# EAGLE design picoAvaR4-routed (EAGLE 6.1)
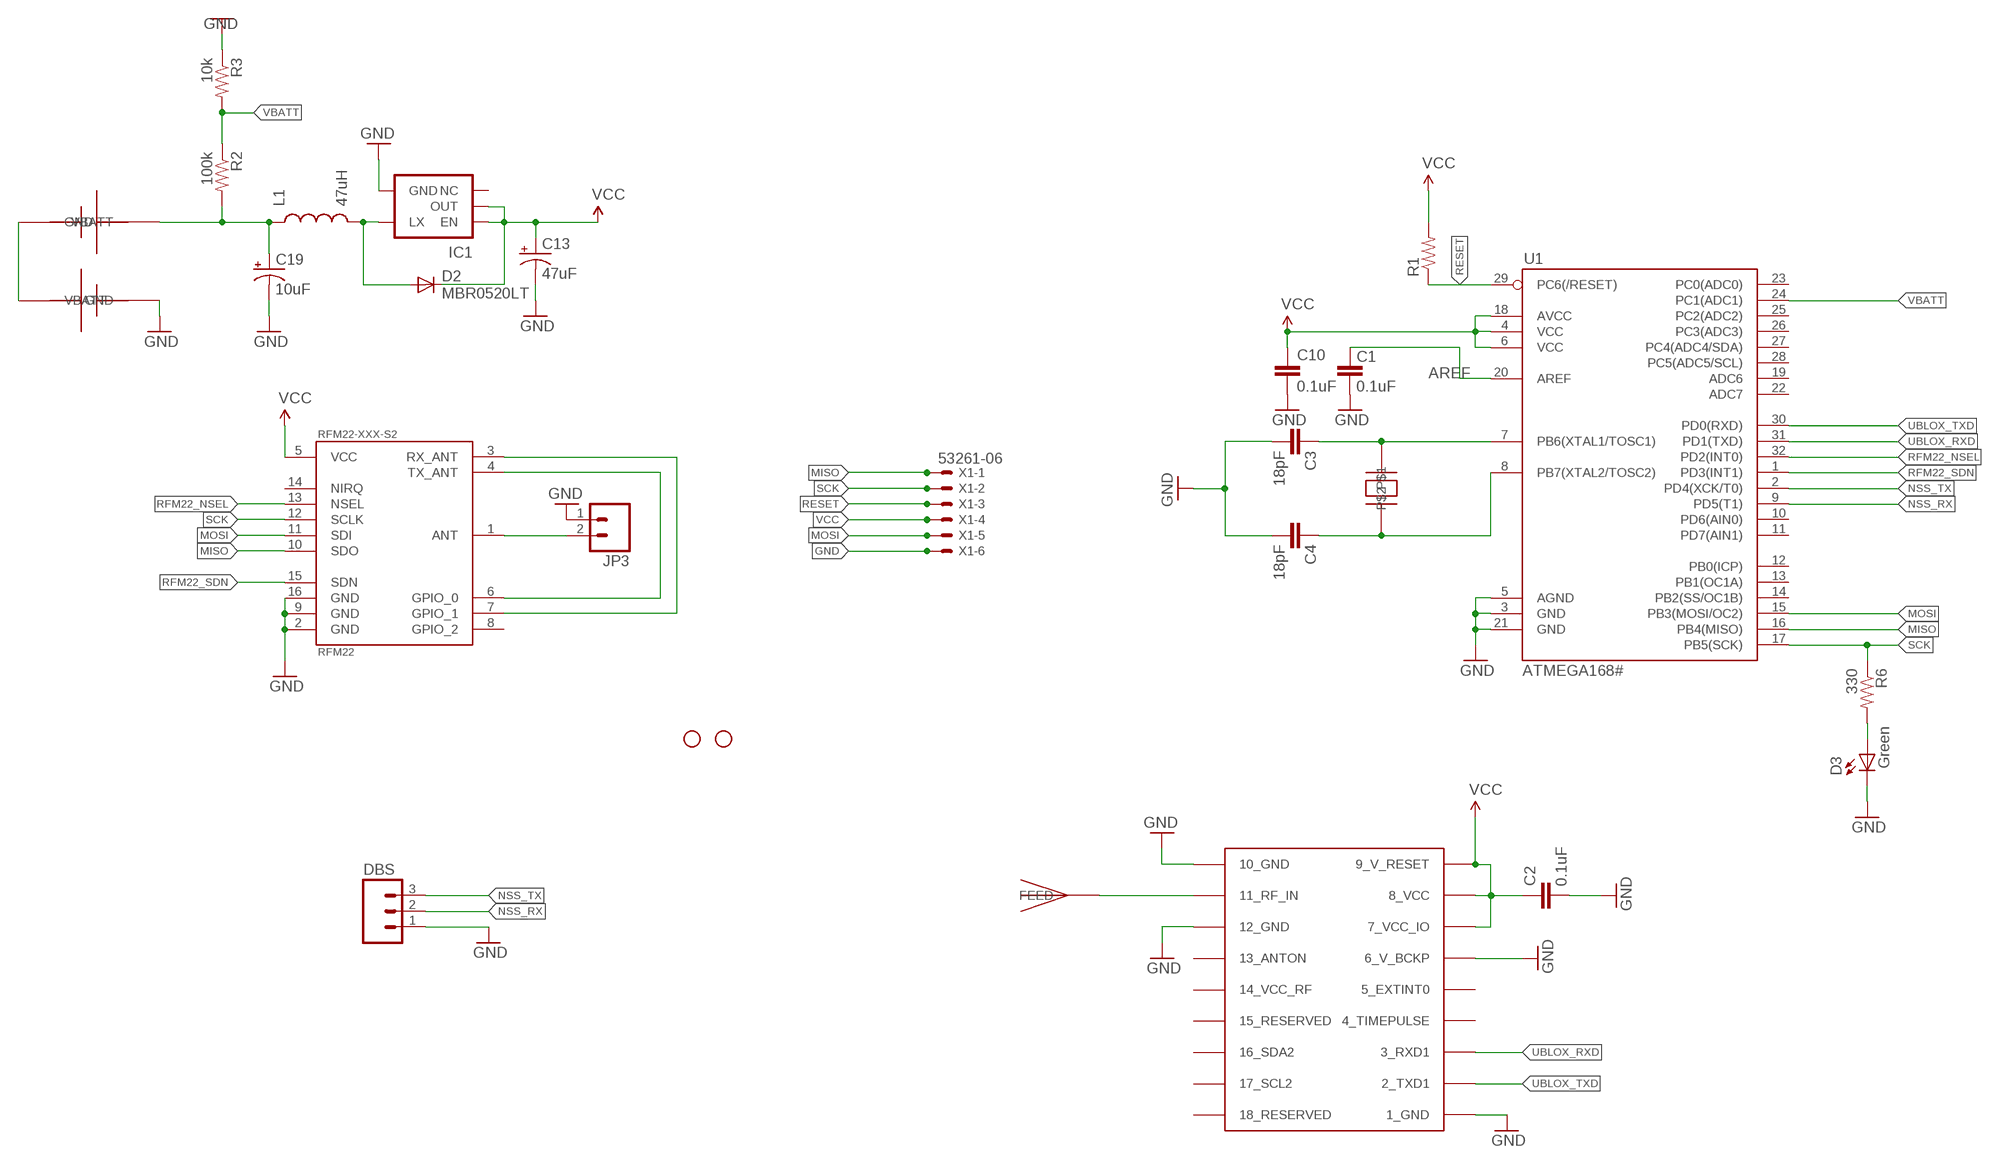
[diagram p0: schematic, sheet 1]

## Parts
C1  0.1uF  CAP0402-CAP  [0402-CAP]
C2  0.1uF  CAP0402-CAP  [0402-CAP]
C3  18pF  CAP0402-CAP  [0402-CAP]
C4  18pF  CAP0402-CAP  [0402-CAP]
C10  0.1uF  CAP0402-CAP  [0402-CAP]
C13  47uF  CAP_POL1206  [EIA3216]
C19  10uF  CAP_POL1206  [EIA3216]
D2  MBR0520LT  [SOD123]
D3  Green  LED0603  [LED-0603]
DBS  M03PTH  [1X03]
IC1  V_REG_NCP1400SOT23-5  [SOT23-5]
JP1  STAND-OFF  [STAND-OFF]
JP2  STAND-OFF  [STAND-OFF]
JP3  M02PTH  [1X02]
L1  47uH  INDUCTOR1210  [1210]
R1  RESISTOR0402-RES  [0402-RES]
R2  100k  RESISTOR0402-RES  [0402-RES]
R3  10k  RESISTOR0402-RES  [0402-RES]
R6  330  RESISTOR0402-RES  [0402-RES]
RFM22-XXX-S2  RFM22  [RFM22-XXX-S2]
U1  ATMEGA168#  ATMEGA168  [TQFP32-08]
U$1  UBLOX_MAX-6  [UBLOX_MAX-6]
U$2  ABRACON_ABM3_CRYSTAL  [ABRACON_ABM3_CRYSTAL]
U$3  JTI_ANTENNA-1575AT43A40  [JTI_ANTENNA-1575AT43A40]
U$4  KEYSTONE-82-AAA-BATTERY-HOLDER  [KEYSTONE-82-AAA-BATTERY]
U$5  KEYSTONE-82-AAA-BATTERY-HOLDER  [KEYSTONE-82-AAA-BATTERY]
X1  53261-06  [53261-06]

## Nets
AREF: C1.2 U1.20(AREF)
BATTERY [vcc]: C19.A(+) L1.1 R2.2 U$4.VBATT U$4.VBATT1(VBATT)
GND [vcc]: C1.1 C2.2 C3.2 C4.2 C10.2 C13.C(-) C19.C(-) D3.C DBS.1 IC1.4(GND) JP3.1 R3.1 RFM22-XXX-S2.2(GND) RFM22-XXX-S2.9(GND) RFM22-XXX-S2.16(GND) U1.3(GND) U1.5(AGND) U1.21(GND) U$1.1_GND U$1.6_V_BCKP U$1.10_GND U$1.12_GND U$5.GND U$5.GND2(GND) X1.6
MISO: RFM22-XXX-S2.10(SDO) U1.16(PB4(MISO)) X1.1
MOSI: RFM22-XXX-S2.11(SDI) U1.15(PB3(MOSI/OC2)) X1.5
N$1: U$4.GND U$4.GND2(GND) U$5.VBATT U$5.VBATT1(VBATT)
N$3: JP3.2 RFM22-XXX-S2.1(ANT)
N$4: U$1.11_RF_IN U$3.FEED
N$5: RFM22-XXX-S2.3(RX_ANT) RFM22-XXX-S2.7(GPIO_1)
N$6: RFM22-XXX-S2.4(TX_ANT) RFM22-XXX-S2.6(GPIO_0)
N$7: D3.A R6.2
N$9: C3.1 U1.7(PB6(XTAL1/TOSC1)) U$2.P$2
N$10: C4.1 U1.8(PB7(XTAL2/TOSC2)) U$2.P$1
N$11: D2.A IC1.5(LX) L1.2
NSS_RX: DBS.2 U1.9(PD5(T1))
NSS_TX: DBS.3 U1.2(PD4(XCK/T0))
RESET: R1.1 U1.29(PC6(/RESET)) X1.3
RFM22_NSEL: RFM22-XXX-S2.13(NSEL) U1.32(PD2(INT0))
RFM22_SDN: RFM22-XXX-S2.15(SDN) U1.1(PD3(INT1))
SCK: R6.1 RFM22-XXX-S2.12(SCLK) U1.17(PB5(SCK)) X1.2
UBLOX_RXD: U1.31(PD1(TXD)) U$1.3_RXD1
UBLOX_TXD: U1.30(PD0(RXD)) U$1.2_TXD1
VBATT [vcc]: R2.1 R3.2 U1.24(PC1(ADC1))
VCC: C2.1 C10.1 C13.A(+) D2.C IC1.1(EN) IC1.2(OUT) R1.2 RFM22-XXX-S2.5(VCC) U1.4(VCC) U1.6(VCC) U1.18(AVCC) U$1.7_VCC_IO U$1.8_VCC U$1.9_V_RESET X1.4
Unconnected: IC1.3(NC) RFM22-XXX-S2.8(GPIO_2) RFM22-XXX-S2.14(NIRQ) U1.10(PD6(AIN0)) U1.11(PD7(AIN1)) U1.12(PB0(ICP)) U1.13(PB1(OC1A)) U1.14(PB2(SS/OC1B)) U1.19(ADC6) U1.22(ADC7) U1.23(PC0(ADC0)) U1.25(PC2(ADC2)) U1.26(PC3(ADC3)) U1.27(PC4(ADC4/SDA)) U1.28(PC5(ADC5/SCL)) U$1.4_TIMEPULSE U$1.5_EXTINT0 U$1.13_ANTON U$1.14_VCC_RF U$1.15_RESERVED U$1.16_SDA2 U$1.17_SCL2 U$1.18_RESERVED

## Library data of the parts
C1-C4 C10 = SparkFun:CAP: Capacitor Standard 0603 ceramic capacitor, and 0.1" leaded capacitor.
C13 C19 = SparkFun:CAP_POL: Capacitor Polarized These are standard SMD and PTH capacitors. Normally 10uF, 47uF, and 100uF in electrolytic and tantalum varieties. Always verify the external diameter of the through hole cap, it varies with capacity, voltage, and manufacturer. The EIA devices should be standard.
D2 = diode:MBR0520LT: SCHOTTKY BARRIER RECTIFIER Source: http://onsemi.com .. MBR0520LT1-D.pdf
D3 = SparkFun:LED: LEDs Standard schematic elements and footprints for 5mm, 3mm, 1206, and 0603 sized LEDs. 5mm - Spark Fun Electronics SKU : COM-00529 (and others)
DBS = SparkFun:M03: Header 3 Standard 3-pin 0.1" header. Use with straight break away headers (SKU : PRT-00116), right angle break away headers (PRT-00553), swiss pins (PRT-00743), machine pins (PRT-00117), and female headers (PRT-00115). Molex polarized connector foot print use with SKU : PRT-08232 with associated crimp pins and housings.
IC1 = SparkFun:V_REG_NCP1400: Switching step-up voltage regulator NCP1400 switiching regulator takes single cell AA and outputs 100mA at 3.3V or 5V with minimal number of external components.
JP1 JP2 = SparkFun:STAND-OFF: Stand Off This is the mechanical footprint for a #4 phillips button head screw. Use the keepout ring to avoid running the screw head into surrounding components. SKU : PRT-00447
JP3 = SparkFun:M02: Header 2 Standard 2-pin 0.1" header. Use with straight break away headers (SKU : PRT-00116), right angle break away headers (PRT-00553), swiss pins (PRT-00743), machine pins (PRT-00117), and female headers (PRT-00115). Molex polarized connector foot print use with SKU : PRT-08233 with associated crimp pins and housings.
L1 = SparkFun:INDUCTOR: Inductors Basic Inductor/Choke - 0603 and 1206. Footprints are not proven and vary greatly between part numbers.
R1-R3 R6 = SparkFun:RESISTOR: Resistor Basic schematic elements and footprints for 0603, 1206, and PTH resistors.
RFM22-XXX-S2 = SparkFun:RFM22: *Hope RF's RFM22* Packages: RFM22-S2 (SMD)
U1 = SparkFun:ATMEGA168
U$1 = ava:UBLOX_MAX-6: UBLOX MAX-6
U$2 = ava:ABRACON_ABM3_CRYSTAL
U$3 = ava:JTI_ANTENNA-1575AT43A40
U$4 U$5 = ava:KEYSTONE-82-AAA-BATTERY-HOLDER
X1 = con-molex:53?-06: CONNECTOR wire to board 1.25 mm (.049 inch) pitch header; OC_FARNELL: 1125375; OC_NEWARK: unknown

## Net classes
0 default: width 0.203 mm
1 vcc: width 0.254 mm

## Board
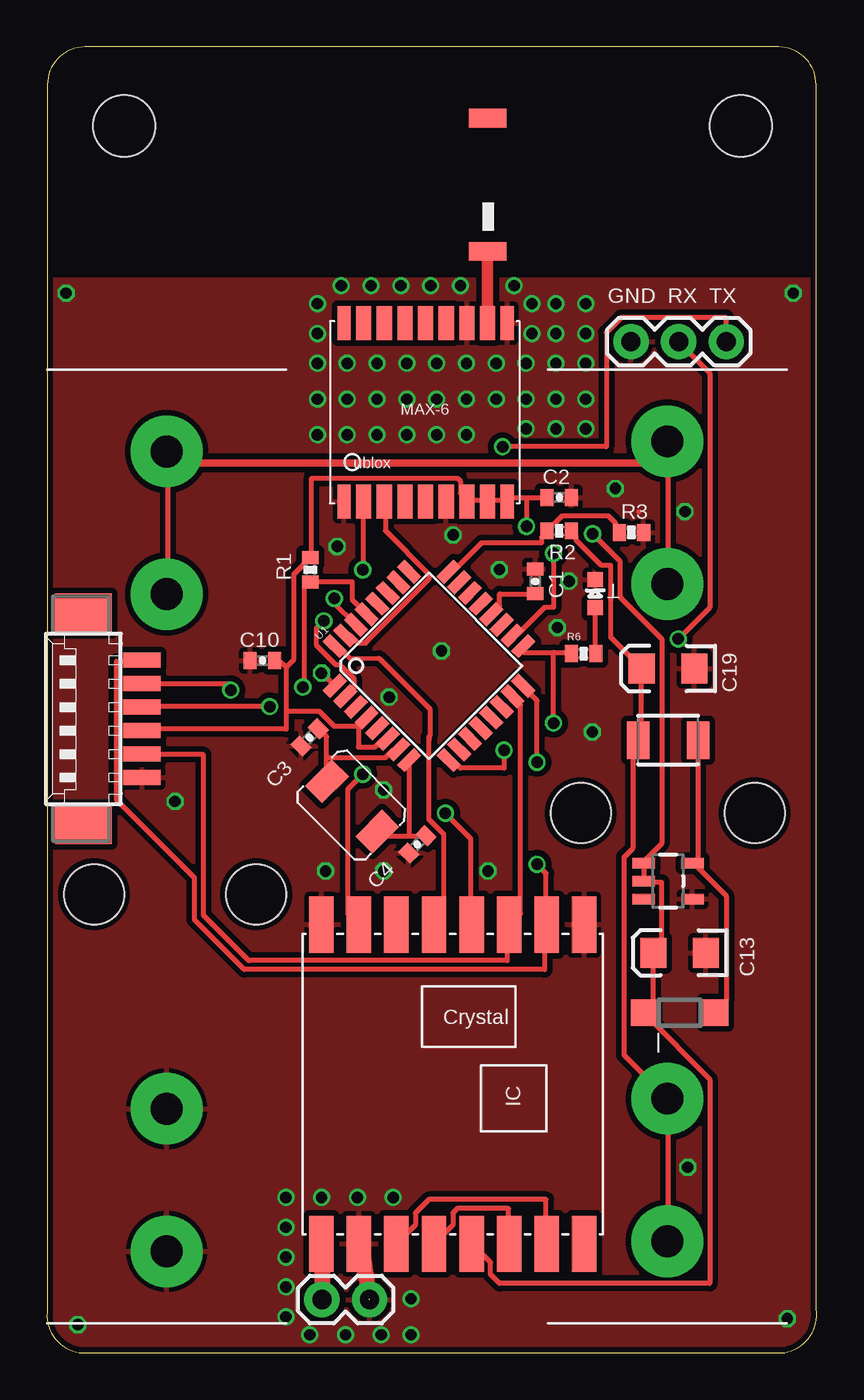
[diagram p1: board, top side]
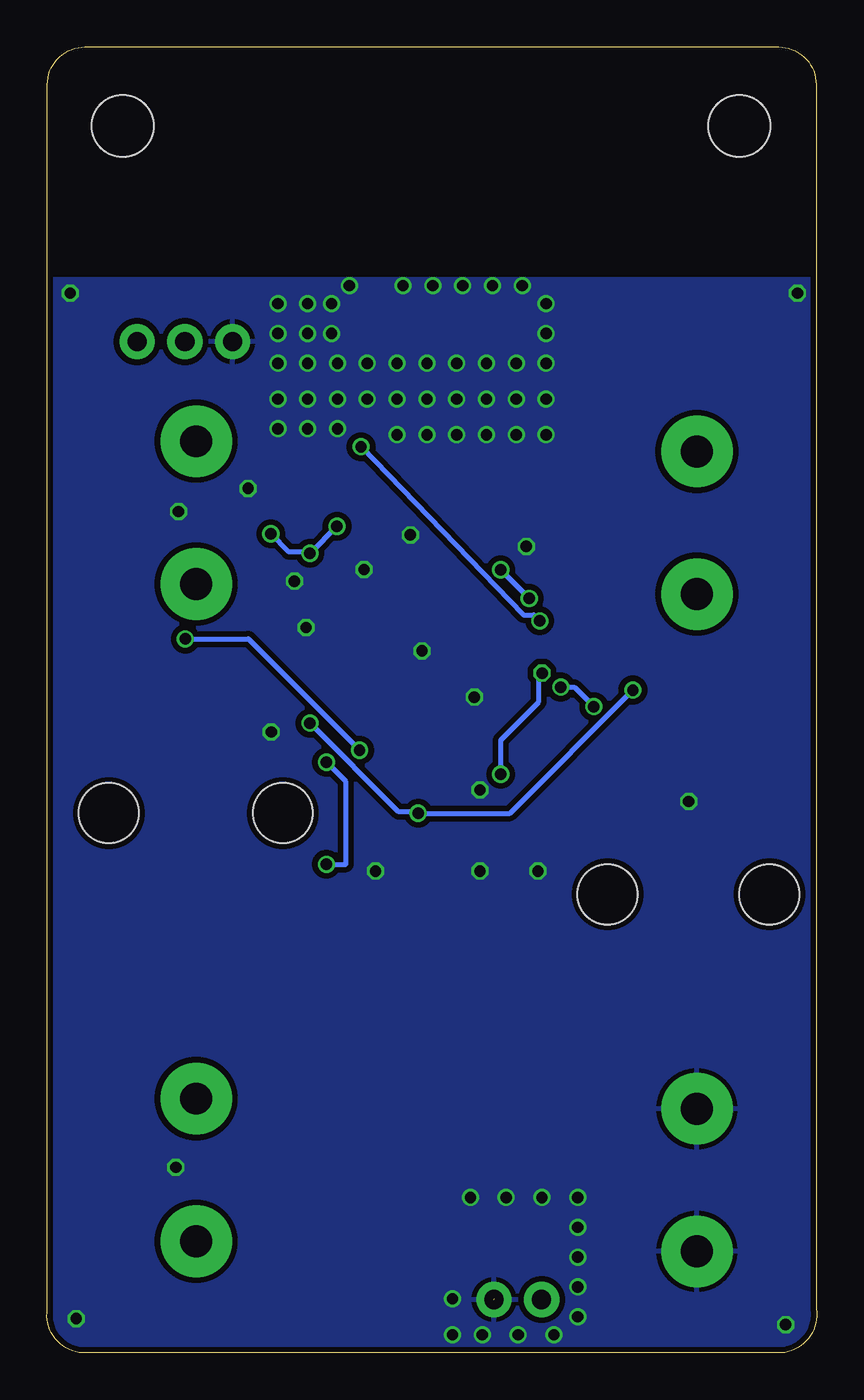
[diagram p2: board, bottom side, seen from below]

Size 40.99 x 69.52 mm. Coordinates in mm from the lower left corner, seen from the top.
Outline: 0.02,67.52 0.02,2.32 arc90 1.71,0 39.29,0 arc90 40.97,2.32 40.97,67.52 arc90 38.97,69.52 2.02,69.52 arc90 0.02,67.52
Copper layers (1*16): Top 0.035mm / dielectric 1.5mm / Bottom 0.035mm
Design rules: minimum track width 6mil, minimum drill 12mil, track to track 6mil, track to pad 6mil, pad to pad 6mil, via to via 6mil, smd to smd 0mil, copper to edge 10mil, drill to drill 10mil, minimum pad ring 10mil, minimum via ring 6mil, stop-mask expansion 2mil, vias tented up to drill 100mil, thermal gap 10mil
Holes 3.2 mm at 11.14,24.4 28.43,28.72 37.69,28.72 2.51,24.4

### Footprints (pad centres in the part's own frame; a part is rotated, then mirrored left to right if it is on the bottom)
0402-CAP = smd 0.7 x 0.9: 1 -0.65,0; 2 0.65,0
EIA3216 = smd 1.4 x 1.6: A 1.4,0; C -1.4,0
SOD123 = smd 1.4 x 1.4: A 1.9,0; C -1.9,0
LED-0603 = smd 0.8 x 0.8: A 0,-0.75; C 0,0.75
1X03 = drill 1.016 pad 1.88: 1 0,0; 2 2.54,0; 3 5.08,0
SOT23-5 = smd 0.55 x 1.2: 1 -0.95,-1.3; 2 0,-1.3; 3 0.95,-1.3; 4 0.95,1.3; 5 -0.95,1.3
STAND-OFF = hole 3.302: 0,0
1X02 = drill 1.016 pad 1.88: 1 0,0; 2 2.54,0
1210 = smd 1.2 x 2: 1 -1.6,0; 2 1.6,0
0402-RES = smd 0.7 x 0.9: 1 -0.65,0; 2 0.65,0
RFM22-XXX-S2 = smd 3 x 1.3: 1 -8.5,7; 2 -8.5,5; 3 -8.5,3; 4 -8.5,1; 5 -8.5,-1; 6 -8.5,-3; 7 -8.5,-5; 8 -8.5,-7; 9 8.5,-7; 10 8.5,-5; 11 8.5,-3; 12 8.5,-1; 13 8.5,1; 14 8.5,3; 15 8.5,5; 16 8.5,7
TQFP32-08 = smd 1.27 x 0.559: 1 -4.293,2.8; 2 -4.293,2; 3 -4.293,1.2; 4 -4.293,0.4; 5 -4.293,-0.4; 6 -4.293,-1.2; 7 -4.293,-2; 8 -4.293,-2.8; 17 4.293,-2.8; 18 4.293,-2; 19 4.293,-1.2; 20 4.293,-0.4; 21 4.293,0.4; 22 4.293,1.2; 23 4.293,2; 24 4.293,2.8 | smd 0.559 x 1.27: 9 -2.8,-4.293; 10 -2,-4.293; 11 -1.2,-4.293; 12 -0.4,-4.293; 13 0.4,-4.293; 14 1.2,-4.293; 15 2,-4.293; 16 2.8,-4.293; 25 2.8,4.293; 26 2,4.293; 27 1.2,4.293; 28 0.4,4.293; 29 -0.4,4.293; 30 -1.2,4.293; 31 -2,4.293; 32 -2.8,4.293
UBLOX_MAX-6 = smd 1.8 x 0.7: 1_GND 4.95,-4.4; 9_V_RESET 4.95,4.3; 10_GND -4.55,4.3; 18_RESERVED -4.55,-4.4 | smd 1.8 x 0.8: 2_TXD1 4.95,-3.35; 3_RXD1 4.95,-2.25; 4_TIMEPULSE 4.95,-1.15; 5_EXTINT0 4.95,-0.05; 6_V_BCKP 4.95,1.05; 7_VCC_IO 4.95,2.15; 8_VCC 4.95,3.25; 11_RF_IN -4.55,3.25; 12_GND -4.55,2.15; 13_ANTON -4.55,1.05; 14_VCC_RF -4.55,-0.05; 15_RESERVED -4.55,-1.15; 16_SDA2 -4.55,-2.25; 17_SCL2 -4.55,-3.35
ABRACON_ABM3_CRYSTAL = smd 1.3 x 2: P$1 -3.4,0.1; P$2 0.4,0.1
JTI_ANTENNA-1575AT43A40 = smd 1 x 2: FEED -3.81,-1.27; NC 3.29,-1.27
KEYSTONE-82-AAA-BATTERY = drill 1.7 pad 3.81: GND -21.57,0; GND2 -13.97,0; VBATT 13.43,0; VBATT1 21.03,0
53261-06 = smd 0.8 x 2: 1 3.125,-2.5; 2 1.875,-2.5; 3 0.625,-2.5; 4 -0.625,-2.5; 5 -1.875,-2.5; 6 -3.125,-2.5 | smd 2.1 x 3: S1 5.625,0.625; S2 -5.625,0.625

### Placement (x,y rotation side)
C1  26.01,41.06 270 top
C2  27.29,45.54 0 top
C3  13.99,32.76 225 top
C4  19.73,27.06 225 top
C10  11.48,36.85 180 top
C13  33.7,21.29 180 top
C19  33.08,36.42 180 top
D2  33.7,18.1 0 top
D3  29.2,40.41 0 top
DBS  31.11,53.83 0 top
IC1  33.08,25.1 270 top
JP1  4.12,65.32 0 top
JP2  36.96,65.32 0 top
JP3  17.19,2.82 180 top
L1  33.08,32.61 0 top
R1  14.03,41.68 90 top
R2  27.29,43.76 0 top
R3  31.13,43.67 180 top
R6  28.58,37.22 0 top
RFM22-XXX-S2  21.61,14.29 90 top
U1  20.34,36.57 45 top
U$1  20.22,50.27 270 top
U$2  15.26,30.21 135 top
U$3  22.2,62.44 90 top
U$4  33.04,26.95 270 top
U$5  6.37,26.95 90 top
X1  2.56,33.74 90 top

### Tracks (layer width: path | path; a pad name or v marks a point on that pad's centre or on a via)
AREF
  Top 0.254: C1.2 25.94,40.4 24.1,40.4 24.1,39.76 23.7,39.36 U1.20
BATTERY
  Top 0.254: R2.2 27.94,43.68 28.18,43.44 28.18,43.28 29.54,41.92 30.02,41.92 30.02,38.08 31.62,36.48 C19.A 31.62,36.32 31.62,32.72 31.54,32.64 L1.1 31.38,32.56 31.22,32.4 31.22,26.88 30.74,26.4 30.74,15.84 32.98,13.6 U$4.VBATT 33.06,13.44 33.06,6 U$4.VBATT1
GND  (via drill 0.6)  (1 unrouted)
  Top 0.254: 31.54,44.76 31.52,44.78
  Top 0.813: 16.85,5.08 17.17,2.86
  other vias: 6.82,29.34 17.93,25.63 14.84,25.63 23.49,25.63 29.05,33.04 15.46,42.92 21.02,37.37 21.64,43.54 24.11,41.69 27.81,41.07 27.19,38.6 30.28,46.01 33.99,44.78 17.93,29.96 18.23,34.9 34.13,9.87 15.99,48.87 19.17,48.87 20.76,48.87 15.99,52.68 17.58,52.68 19.17,52.68 20.76,52.68 15.99,50.77 17.58,50.77 19.17,50.77 20.76,50.77 24.88,56.81 22.03,56.81 14.41,55.85 14.41,54.27 14.41,48.87 14.41,52.68 14.41,50.77 20.44,56.81 18.85,56.81 17.26,56.81 15.68,56.81 23.93,52.68 25.52,52.68 23.93,50.77 25.52,50.77 22.34,48.87 22.34,52.68 22.34,50.77 17.58,48.87 27.11,52.68 27.11,50.77 27.11,49.19 25.52,49.19 28.69,49.19 28.69,50.77 28.69,52.68 27.11,54.27 28.69,54.27 27.11,55.85 28.69,55.85 25.84,54.27 25.84,55.85 19.39,2.86 16.53,8.26 14.63,8.26 12.72,8.26 12.72,6.67 12.72,5.08 12.72,3.49 12.72,1.9 13.99,0.95 15.9,0.95 17.8,0.95 19.39,0.95 18.44,8.26 39.75,56.42 1.02,56.42 39.43,1.81 1.65,1.49
  pour Top (isolate 0.305): 0.02,57.13 40.78,57.13 40.78,0.32 0.02,0.32
  pour Bottom (isolate 0.305): 0.02,57.13 40.78,57.13 40.78,0.32 2.02,0.32 arc-90 0.02,2.32
MISO  (via drill 0.61)
  Top 0.254: v26.1,31.44 26.1,34.72 25.38,35.44 U1.16 | v26.1,26 26.58,25.52 26.58,22.8 RFM22-XXX-S2.10 26.5,22.72 26.5,20.4 10.5,20.4 7.86,23.04 7.86,25.28 3.7,29.44 3.7,36.8 5.06,36.8 X1.1
  Bottom 0.254: v26.1,31.44 25.06,30.4 25.06,26 v26.1,26
MOSI
  Top 0.254: U1.15 24.82,34.88 25.22,34.48 25.22,23.36 24.66,22.8 RFM22-XXX-S2.11 24.5,22.72 24.5,20.88 10.74,20.88 8.34,23.28 8.34,31.84 5.06,31.84 X1.5
N$1
  Top 0.254: U$5.VBATT 6.42,40.4 6.42,47.92 U$5.VBATT1 6.5,47.36 | U$4.GND2 33.06,40.96 33.06,48.48 U$4.GND 32.98,47.36
  Top 0.406: 32.98,47.36 6.5,47.36
N$3
  Top 0.406: RFM22-XXX-S2.1 14.65,5.79
  Top 0.85: 14.65,5.79 JP3.2
N$4
  Top 0.61: U$3.FEED U$1.11_RF_IN
N$5
  Top 0.254: RFM22-XXX-S2.3 19.62,6.8 19.62,7.44 20.34,8.16 26.58,8.16 26.58,5.84 RFM22-XXX-S2.7
N$6
  Top 0.254: RFM22-XXX-S2.4 21.62,6.8 21.62,7.44 21.86,7.68 24.58,7.68 24.58,5.84 RFM22-XXX-S2.6
N$7
  Top 0.254: D3.A 29.22,39.6 29.22,37.28 R6.2
N$9
  Top 0.254: 14.9,31.68 14.9,30.48 U$2.P$2 | 14.9,31.68 14.9,32.8 14.5,33.2 C3.1 | 14.9,31.68 18.02,31.68 18.42,32.08 18.66,32.08 U1.7
N$10
  Top 0.254: 19.3,27.52 17.62,27.52 17.62,27.68 U$2.P$1 | 19.3,27.52 C4.1 | 19.3,27.52 19.3,31.52 U1.8
N$11
  Top 0.254: L1.2 34.66,32.56 34.66,26.32 34.42,26.08 IC1.5 34.5,26 36.18,24.32 36.18,18.72 35.62,18.16 D2.A
NSS_RX  (via drill 0.61)
  Top 0.254: v24.34,32.08 24.34,31.12 22.02,31.12 21.62,31.52 21.46,31.52 U1.9 | v33.62,38 35.3,39.68 35.3,52.16 33.7,53.76 DBS.2
  Bottom 0.254: v24.34,32.08 30.26,38 v33.62,38
NSS_TX  (via drill 0.61)
  Top 0.254: v14.74,38.96 14.34,38.56 14.34,37.68 15.38,36.64 15.62,36.64 16.34,35.92 16.34,35.36 15.94,34.96 U1.2 | v24.26,48.23 29.78,48.23 29.78,54.32 30.58,55.12 36.18,55.12 DBS.3
  Bottom 0.254: v14.74,38.96 15.06,39.28 15.62,39.28 v24.26,48.23
RESET  (via drill 0.61)
  Top 0.254: U1.29 16.98,39.36 16.26,40.08 16.26,41.04 14.1,41.04 R1.1 13.94,40.96 13.7,40.72 13.7,35.52 v13.62,35.44 | v11.86,34.4 5.06,34.4 X1.3
  Bottom 0.254: v11.86,34.4 12.9,35.44 v13.62,35.44
RFM22_NSEL
  Top 0.254: 20.34,32.61 20.34,28.4 21.14,27.6 21.14,23.28 20.66,22.8 RFM22-XXX-S2.13 | 20.34,32.61 20.34,32.8 | U1.32 15.55,37.39 15.71,37.39 15.72,37.38 16.18,36.94 17.68,36.98 17.93,36.75 20.4,34.28 20.4,32.83 20.36,32.79 20.36,32.62 20.34,32.61
RFM22_SDN  (via drill 0.6, 0.61)
  Top 0.254: v16.82,30.8 16.02,30 16.02,23.36 16.58,22.8 RFM22-XXX-S2.15 | v14.62,36.18 14.73,36.11 U1.1
  Bottom 0.254: v16.82,30.8 16.82,32.62 14.79,34.65 14.79,36.17 v14.62,36.18
SCK  (via drill 0.61)
  Top 0.254: 26.98,37.28 25.38,37.28 25.38,37.6 U1.17 | 26.98,37.28 27.86,37.28 R6.1 | v9.78,35.28 9.78,35.6 5.06,35.6 X1.2 | v21.22,28.72 22.58,27.36 22.58,22.8 RFM22-XXX-S2.12 | v26.98,33.52 26.98,37.28
  Bottom 0.254: v9.78,35.28 16.34,28.72 v21.22,28.72 21.3,28.8 22.26,28.8 v26.98,33.52
UBLOX_RXD
  Top 0.254: U1.31 15.94,38.16 16.18,38.16 16.58,37.76 16.98,37.76 16.98,37.84 20.34,41.2 20.34,41.44 18.02,43.76 18.02,45.28 U$1.3_RXD1
UBLOX_TXD  (via drill 0.61)
  Top 0.254: v15.3,40.16 15.3,39.92 16.42,38.8 U1.30 | v16.82,41.68 16.82,45.28 U$1.2_TXD1
  Bottom 0.254: v16.82,41.68 v15.3,40.16
VBATT
  Top 0.254: U1.24 21.46,41.6 21.62,41.6 23.14,43.12 26.34,43.12 26.34,43.44 26.58,43.68 R2.1 26.66,43.76 27.46,44.56 29.88,44.56 30.28,44.16 30.28,43.8 R3.2
VCC  (via drill 0.61)
  Top 0.254: RFM22-XXX-S2.5 22.66,5.76 23.62,4.8 23.62,4.16 24.1,3.68 35.3,3.68 35.3,14.56 31.86,18 D2.C 31.86,18.16 32.26,18.56 32.26,21.28 C13.A 32.34,21.36 32.74,21.76 32.74,25.04 31.86,25.04 IC1.2 31.78,25.12 31.78,26 IC1.1 31.78,26.16 32.74,27.12 32.74,38 30.5,40.24 30.5,42.16 v29.06,43.6 | 25.54,45.52 24.58,45.52 24.58,45.36 U$1.9_V_RESET 24.42,45.36 23.54,45.36 U$1.8_VCC 23.46,45.36 22.42,45.36 U$1.7_VCC_IO 22.34,45.44 22.02,45.76 22.02,46.4 21.86,46.56 14.1,46.56 14.1,42.4 R1.2 13.14,41.44 13.14,36.96 arc-45 13.09,36.82 12.74,36.48 | 25.54,45.52 26.58,45.52 C2.1 | v26.98,42.56 26.98,39.68 26.5,39.68 25.06,38.24 24.82,38.24 U1.18 | 25.54,45.52 v25.54,44 | 16.58,33.36 16.58,32.24 17.46,32.24 17.86,32.64 18.1,32.64 U1.6 | 16.58,33.36 16.98,33.76 U1.4 | 12.74,36.48 12.74,34.16 | 12.74,34.16 12.74,33.2 5.06,33.2 X1.4 | 16.58,33.36 15.3,33.36 14.5,34.16 12.74,34.16 | C10.1 arc-45 12.58,36.66 12.72,36.51 arc45 12.74,36.49 12.74,36.48
  Bottom 0.254: v25.54,44 v26.98,42.56 27.06,42.64 28.1,42.64 v29.06,43.6

### Text on the board
tPlace: GND | RX | TX | T | |
bStop: + | - | picoTracker Rev4 | 2E0UPU | http://ukhas.org.uk | + | -